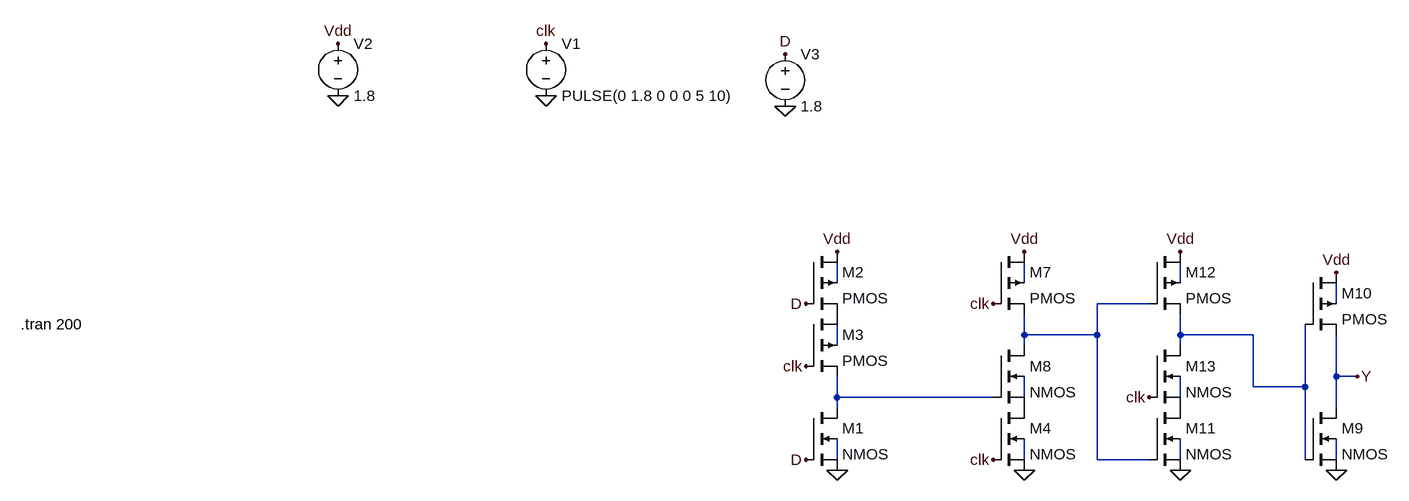
[diagram p0: schematic D_FF_2.asc]
D_FF_2.asc, the LTspice schematic file:
Version 4
SHEET 1 880 680
WIRE -384 32 -384 0
WIRE -96 32 -96 0
WIRE 144 32 144 0
WIRE 96 64 16 64
WIRE 384 64 384 32
WIRE -96 112 -96 80
WIRE 16 112 16 64
WIRE 16 112 -96 112
WIRE 144 112 144 80
WIRE 256 112 144 112
WIRE -384 128 -384 96
WIRE -96 128 -96 112
WIRE 144 128 144 112
WIRE 384 176 384 112
WIRE 416 176 384 176
WIRE 256 192 256 112
WIRE 336 192 336 96
WIRE 336 192 256 192
WIRE -384 208 -384 176
WIRE -144 208 -384 208
WIRE -96 208 -96 176
WIRE 144 208 144 176
WIRE -384 224 -384 208
WIRE 384 224 384 176
WIRE -384 304 -384 272
WIRE -384 304 -400 304
WIRE -96 304 -96 272
WIRE -96 304 -112 304
WIRE 16 304 16 112
WIRE 96 304 16 304
WIRE 144 304 144 272
WIRE 144 304 128 304
WIRE 336 304 336 192
WIRE 384 304 384 272
FLAG -384 -16 Vdd
FLAG -832 -336 clk
FLAG -832 -256 0
FLAG -1152 -336 Vdd
FLAG -1152 -256 0
FLAG -464 -320 D
FLAG -464 -240 0
FLAG -384 320 0
FLAG -432 64 D
FLAG -432 304 D
FLAG -432 160 clk
FLAG -96 -16 Vdd
FLAG -96 320 0
FLAG -144 64 clk
FLAG -144 304 clk
FLAG 384 320 0
FLAG 384 16 Vdd
FLAG 144 -16 Vdd
FLAG 144 320 0
FLAG 96 208 clk
FLAG 416 176 Y
SYMBOL nmos4 -432 224 R0
SYMATTR InstName M1
SYMATTR Value2 l=0.13u w=0.13u
SYMBOL pmos4 -432 -16 R0
SYMATTR InstName M2
SYMATTR Value2 l=0.13u w=0.52u
SYMBOL voltage -832 -352 R0
WINDOW 123 0 0 Left 0
WINDOW 39 0 0 Left 0
SYMATTR InstName V1
SYMATTR Value PULSE(0 1.8 0 0 0 5 10)
SYMBOL voltage -1152 -352 R0
WINDOW 123 0 0 Left 0
WINDOW 39 0 0 Left 0
SYMATTR InstName V2
SYMATTR Value 1.8
SYMBOL voltage -464 -336 R0
WINDOW 123 0 0 Left 0
WINDOW 39 0 0 Left 0
SYMATTR InstName V3
SYMATTR Value 1.8
SYMBOL pmos4 -432 80 R0
SYMATTR InstName M3
SYMATTR Value2 l=0.13u w=0.52u
SYMBOL nmos4 -144 224 R0
SYMATTR InstName M4
SYMATTR Value2 l=0.13u w=0.26u
SYMBOL pmos4 -144 -16 R0
SYMATTR InstName M7
SYMATTR Value2 l=0.13u w=5u
SYMBOL nmos4 -144 128 R0
SYMATTR InstName M8
SYMATTR Value2 l=0.13u w=0.26u
SYMBOL nmos4 336 224 R0
SYMATTR InstName M9
SYMATTR Value2 l=0.13u w=0.13u
SYMBOL pmos4 336 16 R0
SYMATTR InstName M10
SYMATTR Value2 l=0.13u w=0.26u
SYMBOL nmos4 96 224 R0
SYMATTR InstName M11
SYMATTR Value2 l=0.13u w=0.26u
SYMBOL pmos4 96 -16 R0
SYMATTR InstName M12
SYMATTR Value2 l=0.13u w=0.26u
SYMBOL nmos4 96 128 R0
SYMATTR InstName M13
SYMATTR Value2 l=0.13u w=0.26u
TEXT -1640 96 Left 2 !.tran 200

The netlist it stands for:
* D_FF_2.asc
M1 N008 D 0 N011 NMOS l=0.13u w=0.13u
M2 Vdd D P001 N001 PMOS l=0.13u w=0.52u
V1 clk 0 PULSE(0 1.8 0 0 0 5 10)
V2 Vdd 0 1.8
V3 D 0 1.8
M3 P001 clk N008 N007 PMOS l=0.13u w=0.52u
M4 P002 clk 0 N012 NMOS l=0.13u w=0.26u
M7 Vdd clk N004 N002 PMOS l=0.13u w=5u
M8 N004 N008 P002 N009 NMOS l=0.13u w=0.26u
M9 Y N006 0 N014 NMOS l=0.13u w=0.13u
M10 Vdd N006 Y N005 PMOS l=0.13u w=0.26u
M11 P003 N004 0 N013 NMOS l=0.13u w=0.26u
M12 Vdd N004 N006 N003 PMOS l=0.13u w=0.26u
M13 N006 clk P003 N010 NMOS l=0.13u w=0.26u
.model NMOS NMOS
.model PMOS PMOS
.lib standard.mos
.tran 200
.backanno
.end